# EAGLE design rs485-shield (EAGLE 6.2)
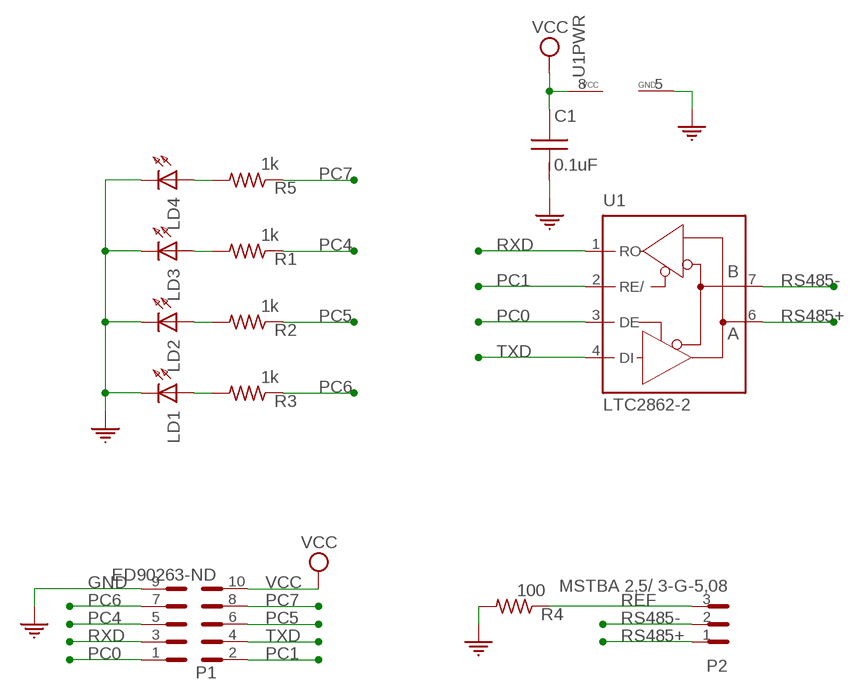
[diagram p0: schematic, sheet 1]

## Parts
C1  0.1uF  C-US-0805  [C0805]
LD1  LED-3MM  [LED-3MM]
LD2  LED-3MM  [LED-3MM]
LD3  LED-3MM  [LED-3MM]
LD4  LED-3MM  [LED-3MM]
P1  ED90263-ND  PINHEADER2X5-0.1"SPACING  [PINHD2X5]
P2  MSTBA 2,5/ 3-G-5,08  PINHEADER1X3-MSTBA  [CON-MSTBA]
R1  1k  R_-RES50/500_  [RES50/500]
R2  1k  R_-RES50/500_  [RES50/500]
R3  1k  R_-RES50/500_  [RES50/500]
R4  100  R_-RES50/500_  [RES50/500]
R5  1k  R_-RES50/500_  [RES50/500]
U1  LTC2862-2  RS485-TRANSCEIVER-SOP8  [SOP08]

## Nets
GND: C1.2 LD1.C LD2.C LD3.C LD4.C P1.9 R4.2 U1.5(GND)
N$2: LD4.A R5.2
N$8: LD3.A R1.2
N$9: LD2.A R2.2
N$10: LD1.A R3.2
PC0: P1.1 U1.3(DE)
PC1: P1.2 U1.2(RE/)
PC4: P1.5 R1.1
PC5: P1.6 R2.1
PC6: P1.7 R3.1
PC7: P1.8 R5.1
REF: P2.3 R4.1
RS485+: P2.1 U1.6(A)
RS485-: P2.2 U1.7(B)
RXD: P1.3 U1.1(RO)
TXD: P1.4 U1.4(DI)
VCC: C1.1 P1.10 U1.8(VCC)

## Library data of the parts
C1 = TWS:C-US: Cap non pol. Last edited: 3/20/2007, Added Package C0402. Last edited 11-17-2004: Added Package 1210. Edited 08-11-2004: Added Package CXC12,5B5-1
LD1-LD4 = TWS:LED: Single LED
P1 = TWS:PINHEADER2X5: Pinheader 2x5 Last modified 08-19-2004: Added Footprint 0.1" Spacing 07-29-2004: Added Foot Print for AVR-JTAG
P2 = TWS:PINHEADER1X3: Last edited 09-25-2004: Added Package CON-703W-00/54
R1-R5 = TWS:R_?_*
U1 = TWS:RS485-TRANSCEIVER: RS485 Transceiver/Driver MAX481/75XX184/Etc. Created 08-16-2004

## Board
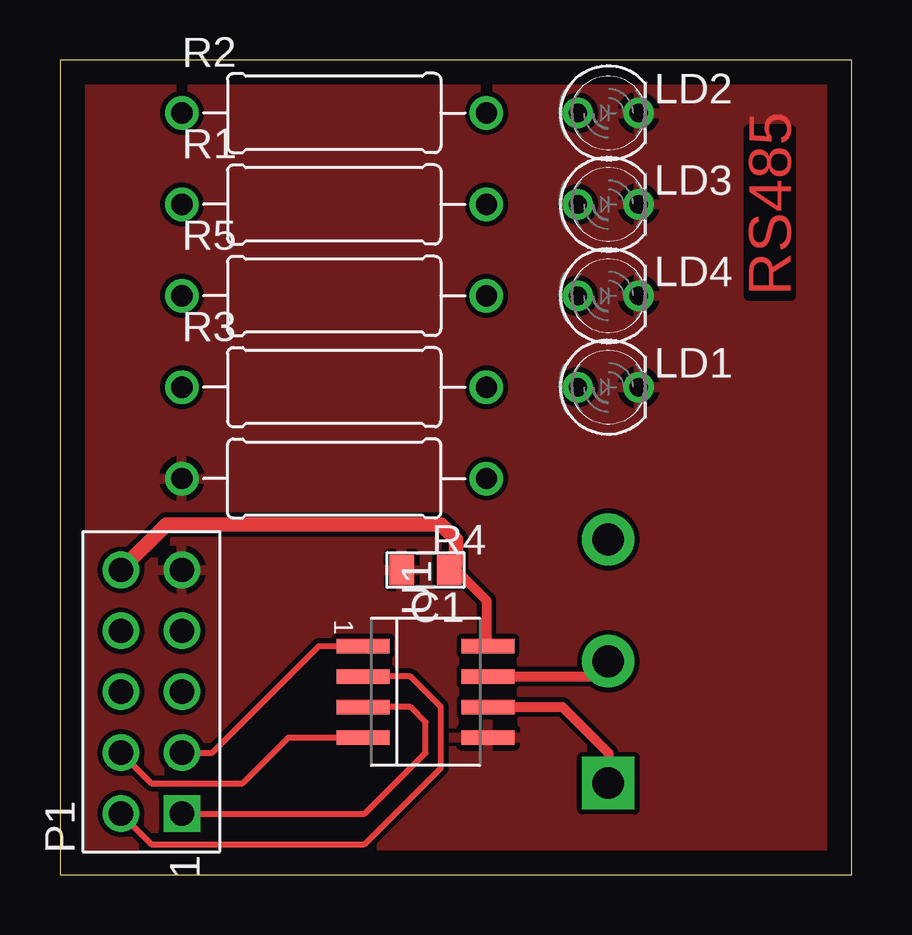
[diagram p1: board, top side]
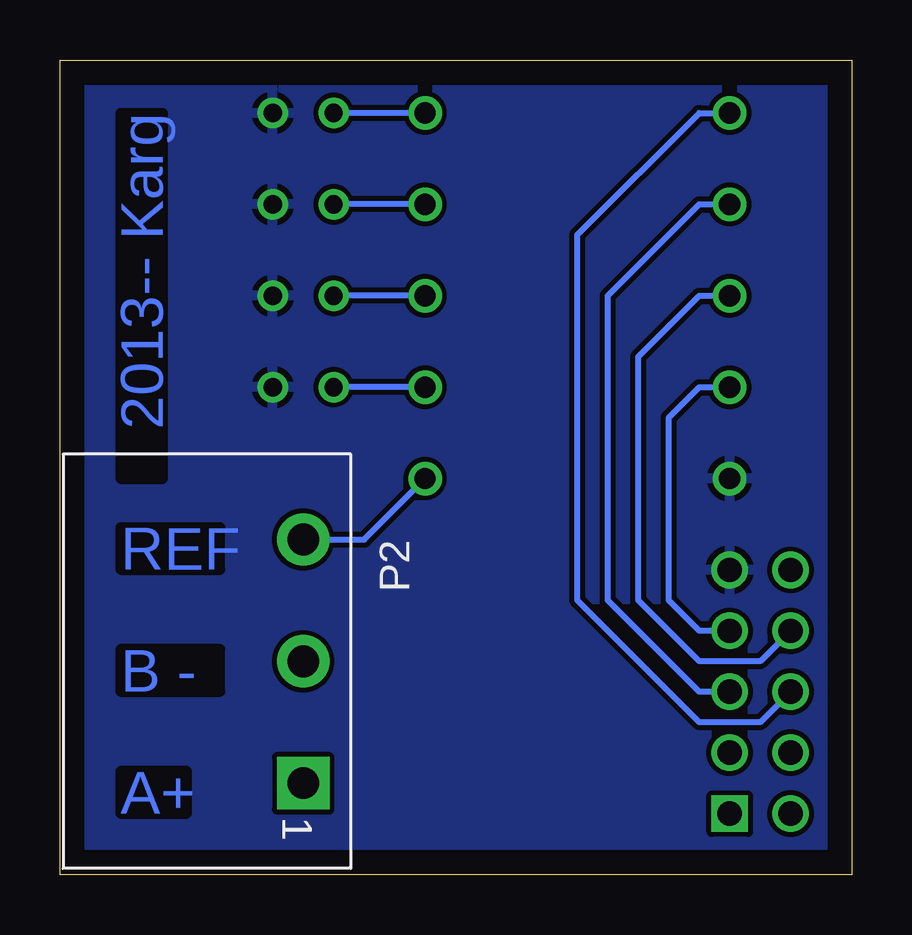
[diagram p2: board, bottom side, seen from below]

Size 33 x 33.96 mm. Coordinates in mm from the lower left corner, seen from the top.
Outline: 0,0 33,0 33,33.96 0,33.96 0,0
Copper layers (1*16): Top_Copper 0.035mm / dielectric 1.5mm / Bottom_Copper 0.035mm
Design rules: minimum track width 10mil, minimum drill 0.6mm, track to track 8mil, track to pad 8mil, pad to pad 8mil, via to via 8mil, smd to smd 8mil, copper to edge 40mil, drill to drill 8mil, minimum pad ring 10mil, minimum via ring 8mil, stop-mask expansion 4mil, vias tented up to drill 0mil, thermal gap 10mil

### Footprints (pad centres in the part's own frame; a part is rotated, then mirrored left to right if it is on the bottom)
C0805 = smd 1.016 x 1.27: 1 -0.991,0; 2 0.991,0
LED-3MM = drill 0.762: A -1.27,0; C 1.27,0
PINHD2X5 = drill 1.016 square: 1 -5.08,-1.27 | drill 1.016: 2 -5.08,1.27; 3 -2.54,-1.27; 4 -2.54,1.27; 5 0,-1.27; 6 0,1.27; 7 2.54,-1.27; 8 2.54,1.27; 9 5.08,-1.27; 10 5.08,1.27
CON-MSTBA = drill 1.321 pad 2.184 square: 1 5.08,0 | drill 1.321 pad 2.184: 2 0,0; 3 -5.08,0
RES50/500 = drill 0.889: 1 -6.35,0; 2 6.35,0
SOP08 = smd 0.6 x 2.2: 1 -1.905,-2.6; 2 -0.635,-2.6; 3 0.635,-2.6; 4 1.905,-2.6; 5 1.905,2.6; 6 0.635,2.6; 7 -0.635,2.6; 8 -1.905,2.6

### Placement (x,y rotation side)
C1  15.24,12.7 180 top
LD1  22.86,20.32 0 top
LD2  22.86,31.75 0 top
LD3  22.86,27.94 0 top
LD4  22.86,24.13 0 top
P1  3.81,7.62 90 top
P2  22.86,8.89 270 bottom
R1  11.43,27.94 0 top
R2  11.43,31.75 0 top
R3  11.43,20.32 0 top
R4  11.43,16.51 180 top
R5  11.43,24.13 0 top
U1  15.24,7.62 270 top

### Tracks (layer width: path | path; a pad name or v marks a point on that pad's centre or on a via)
GND
  pour Bottom_Copper: 0,34.29 33.02,34.29 33.02,0 0,0
  pour Top_Copper: 0,34.29 33.02,34.29 33.02,0 0,0
N$2
  Bottom_Copper 0.254: R5.2 LD4.A
N$8
  Bottom_Copper 0.254: R1.2 LD3.A
N$9
  Bottom_Copper 0.254: R2.2 LD2.A
N$10
  Bottom_Copper 0.254: R3.2 LD1.A
PC0
  Top_Copper 0.254: P1.1 12.7,2.54 15.24,5.08 15.24,6.35 14.61,6.99 U1.3
PC1
  Top_Copper 0.254: P1.2 3.81,1.27 12.7,1.27 15.88,4.45 15.88,6.99 14.61,8.26 U1.2
PC4
  Bottom_Copper 0.254: P1.5 6.35,7.62 10.16,11.43 10.16,24.13 6.35,27.94 R1.1
PC5
  Bottom_Copper 0.254: P1.6 3.81,6.35 6.35,6.35 11.43,11.43 11.43,26.67 6.35,31.75 R2.1
PC6
  Bottom_Copper 0.254: R3.1 6.35,20.32 7.62,19.05 7.62,11.43 6.35,10.16 P1.7
PC7
  Bottom_Copper 0.254: R5.1 6.35,24.13 8.89,21.59 8.89,11.43 6.35,8.89 3.81,8.89 P1.8
REF
  Bottom_Copper 0.254: R4.1 20.32,13.97 P2.3
RS485+
  Top_Copper 0.406: U1.6 20.95,6.99 22.86,5.08 P2.1
RS485-
  Top_Copper 0.406: U1.7 22.23,8.26 P2.2
RXD
  Top_Copper 0.254: P1.3 6.35,5.08 10.79,9.53 U1.1
TXD
  Top_Copper 0.254: P1.4 3.81,3.81 7.62,3.81 9.53,5.71 U1.4
VCC
  Top_Copper 0.406: C1.1 16.51,12.7 17.78,11.43 17.78,9.59 U1.8
  Top_Copper 0.61: P1.10 4.45,14.61 15.88,14.61 16.51,13.97 16.51,12.98 C1.1

### Text on the board
Top_Copper: RS485
Bottom_Copper: 2013-- Karg | REF | B - | A+